# EAGLE schematic mippe_mobo (EAGLE 9.5.2)

## Sheet 1 of 2
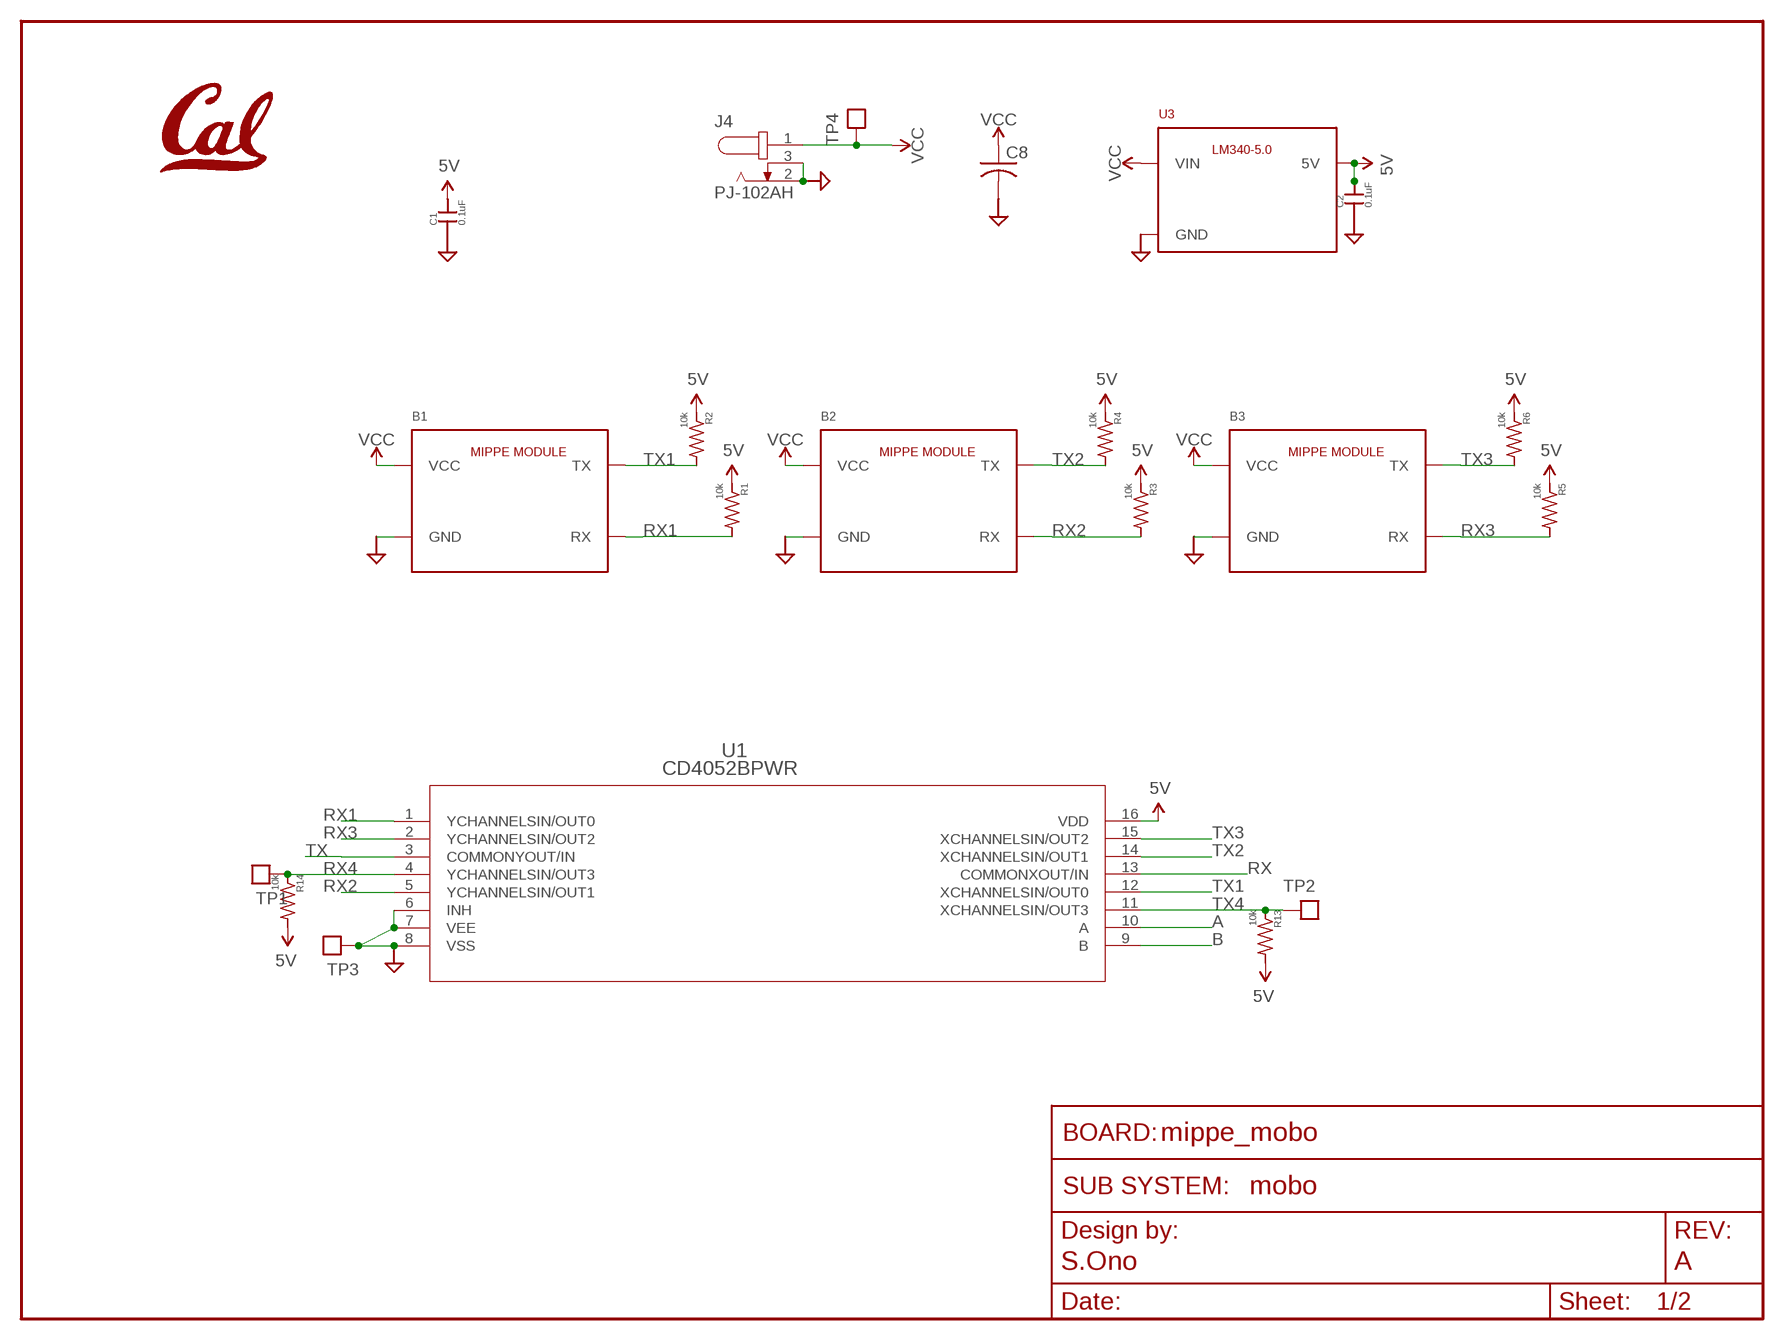
[diagram p0: schematic, sheet 1]
FRAME1 (FRAME_SCHEMATIC): AUTHOR: S.Ono; REV: A; SUBSYSTEM_NAME: mobo

### Parts
B1  MIPPE_MOD  [MIPPE_MOD]
B2  MIPPE_MOD  [MIPPE_MOD]
B3  MIPPE_MOD  [MIPPE_MOD]
C1  0.1uF  CAP0402-CAP  [0402-CAP]
C2  0.1uF  CAP0603-CAP  [0603-CAP]
C8  CAP_ELEC_3MM_SMD  [CAP_3MM]
J4  PJ-102AH  [CUI_PJ-102AH]
L1  UCB_CAL500MIL  [UCB_CAL_500MIL]
R1  10k  R-US_R0402  [R0402]
R2  10k  R-US_R0402  [R0402]
R3  10k  R-US_R0402  [R0402]
R4  10k  R-US_R0402  [R0402]
R5  10k  R-US_R0402  [R0402]
R6  10k  R-US_R0402  [R0402]
R13  10k  R-US_R0402  [R0402]
R14  10k  R-US_R0402  [R0402]
TP1  TEST_POINTTHRU  [TEST_POINT]
TP2  TEST_POINTTHRU  [TEST_POINT]
TP3  TEST_POINTTHRU  [TEST_POINT]
TP4  TEST_POINTTHRU  [TEST_POINT]
U1  CD4052BPWR  [PW16]
U3  LM340MPX-5.0230  [SOT230P700X180-4N]

### Nets
5V: C1.2 C2.2 R1.1 R2.1 R3.1 R4.1 R5.1 R6.1 R13.2 R14.2 U1.16(VDD) U3.3(5V)
A: U1.10(A) ; also sheet 2
B: U1.9(B) ; also sheet 2
GND: B1.GND@0(GND) B1.GND@1(GND) B1.GND@2(GND) B1.GND@3(GND) B2.GND@0(GND) B2.GND@1(GND) B2.GND@2(GND) B2.GND@3(GND) B3.GND@0(GND) B3.GND@1(GND) B3.GND@2(GND) B3.GND@3(GND) C1.1 C2.1 C8.NEG J4.2 J4.3 TP3.1 U1.6(INH) U1.7(VEE) U1.8(VSS) U3.2(GND) U3.4(GND) ; also sheet 2
RX: U1.13(COMMONXOUT/IN) ; also sheet 2
RX1: B1.RX R1.2 U1.1(YCHANNELSIN/OUT0)
RX2: B2.RX R3.2 U1.5(YCHANNELSIN/OUT1)
RX3: B3.RX R5.2 U1.2(YCHANNELSIN/OUT2)
RX4: R14.1 TP1.1 U1.4(YCHANNELSIN/OUT3)
TX: U1.3(COMMONYOUT/IN) ; also sheet 2
TX1: B1.TX R2.2 U1.12(XCHANNELSIN/OUT0)
TX2: B2.TX R4.2 U1.14(XCHANNELSIN/OUT1)
TX3: B3.TX R6.2 U1.15(XCHANNELSIN/OUT2)
TX4: R13.1 TP2.1 U1.11(XCHANNELSIN/OUT3)
VCC: B1.VCC@0(VCC) B1.VCC@1(VCC) B1.VCC@2(VCC) B1.VCC@3(VCC) B2.VCC@0(VCC) B2.VCC@1(VCC) B2.VCC@2(VCC) B2.VCC@3(VCC) B3.VCC@0(VCC) B3.VCC@1(VCC) B3.VCC@2(VCC) B3.VCC@3(VCC) C8.POS J4.1 TP4.1 U3.1(VIN)

## Sheet 2 of 2
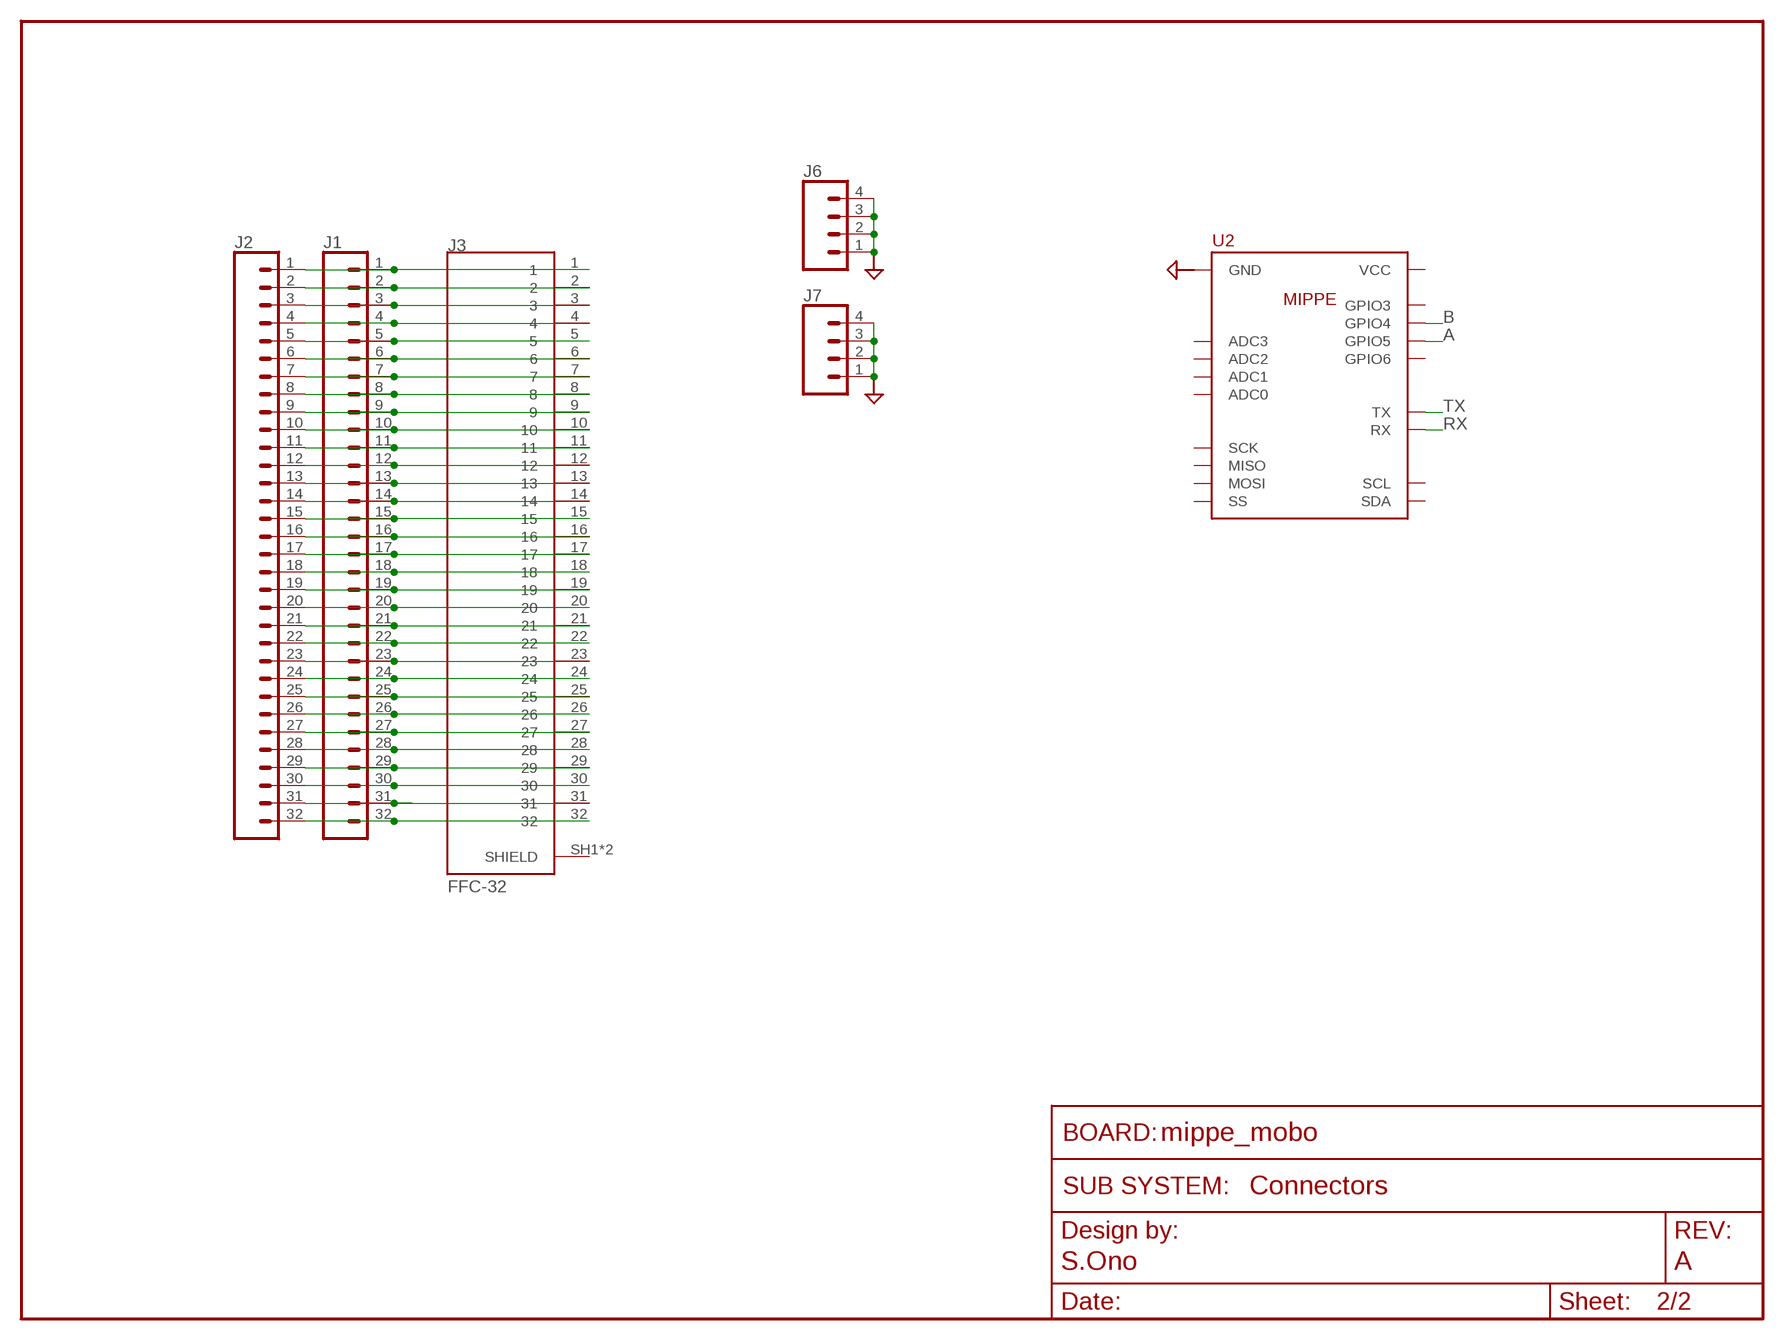
[diagram p1: schematic, sheet 2]
FRAME2 (FRAME_SCHEMATIC): AUTHOR: S.Ono; REV: A; SUBSYSTEM_NAME: Connectors

### Parts
J1  CONN_32  [1X32]
J2  CONN_32  [1X32]
J3  FFC-32  [MOLEX_503480-3200]
J6  CONN_04  [1X04]
J7  CONN_04  [1X04]
U2  MIPPE  [MIPPE]

### Nets
A: U2.GPIO5 ; also sheet 1
B: U2.GPIO4 ; also sheet 1
GND: J6.1 J6.2 J6.3 J6.4 J7.1 J7.2 J7.3 J7.4 U2.GND@0(GND) U2.GND@1(GND) ; also sheet 1
N$1: J1.1 J2.1 J3.1
N$2: J1.2 J2.2 J3.2
N$3: J1.3 J2.3 J3.3
N$4: J1.4 J2.4 J3.4
N$5: J1.5 J2.5 J3.5
N$6: J1.6 J2.6 J3.6
N$7: J1.7 J2.7 J3.7
N$8: J1.8 J2.8 J3.8
N$9: J1.9 J2.9 J3.9
N$10: J1.10 J2.10 J3.10
N$11: J1.11 J2.11 J3.11
N$12: J1.12 J2.12 J3.12
N$13: J1.13 J2.13 J3.13
N$14: J1.14 J2.14 J3.14
N$15: J1.15 J2.15 J3.15
N$16: J1.16 J2.16 J3.16
N$17: J1.17 J2.17 J3.17
N$18: J1.18 J2.18 J3.18
N$19: J1.19 J2.19 J3.19
N$20: J1.20 J2.20 J3.20
N$21: J1.21 J2.21 J3.21
N$22: J1.22 J2.22 J3.22
N$23: J1.23 J2.23 J3.23
N$24: J1.24 J2.24 J3.24
N$25: J1.25 J2.25 J3.25
N$26: J1.26 J2.26 J3.26
N$27: J1.27 J2.27 J3.27
N$28: J1.28 J2.28 J3.28
N$29: J1.29 J2.29 J3.29
N$30: J1.30 J2.30 J3.30
N$31: J1.31 J2.31 J3.31
N$32: J1.32 J2.32 J3.32
RX: U2.RX ; also sheet 1
TX: U2.TX ; also sheet 1
Unconnected: J3.SH1(SHIELD) J3.SH2(SHIELD) U2.ADC0 U2.ADC1 U2.ADC2 U2.ADC3 U2.GPIO3 U2.GPIO6 U2.MISO U2.MOSI U2.SCK U2.SCL U2.SDA U2.SS U2.VCC U2.VCC@1(VCC)

## Library data of the parts
B1-B3 = scono:MIPPE_MOD
C1 C2 = scono:CAP: Capacitor Standard 0603 ceramic capacitor, and 0.1" leaded capacitor.; PIE-INT-REF-NUM: CAPACITOR-GENERIC
C8 = scono:CAP_ELEC: https://www.digikey.com/product-detail/en/nichicon/UWX1C100MCL2GB/493-2099-1-ND/590074
J1 J2 = scono:CONN_32: Multi connection point. Often used as Generic Header-pin footprint for 0.1 inch spaced/style header connections On any of the 0.1 inch spaced packages, you can populate with these: Break Away Headers - Straight <https://www.sparkfun.com/products/116> (PRT-00116) Break Away Male Headers - Right Angle <https://www.sparkfun.com/products/553> (PRT-00553) Female Headers <https://www.sparkfun.com/products/115> (PRT-00115) Break Away Headers - Machine Pin <https://www.sparkfun.com/products/117> (PRT-00117) Break Away Female Headers - Swiss Machine Pin <https://www.sparkfun.com/products/743> (PRT-00743) Arduino Stackable Header - 8 Pin <https://www.sparkfun.com/products/9279> (PRT-09279) For SCREWTERMINALS and SPRING TERMINALS visit here: Screw Terimnals on SparkFun.com <https://www.sparkfun.com/search/results?term=Screw+Terminals> (5mm/3.5mm/2.54mm spacing) This device is also useful as a general connection point to wire up your design to another part of your project. Our various solder wires solder well into these plated through hole pads. Hook-Up Wire - Assortment (Stranded, 22 AWG) <https://www.sparkfun.com/products/11375> (PRT-11375) Hook-Up Wire - Assortment (Solid Core, 22 AWG) <https://www.sparkfun.com/products/11367> (PRT-11367) View the entire wire category on our website here <https://www.sparkfun.com/categories/141> Special notes: Molex polarized connector foot print use with SKU : PRT-08231 with associated crimp pins and housings. 1MM SMD Version SKU: PRT-10208 NOTES ON THE VARIANTS LOCK and LOCK_LONGPADS... This footprint was designed to help hold the alignment of a through-hole component (i.e. 6-pin header) while soldering it into place. You may notice that each hole has been shifted either up or down by 0.005 of an inch from it's more standard position (which is a perfectly straight line). This slight alteration caused the pins (the squares in the middle) to touch the edges of the holes. Because they are alternating, it causes a "brace" to hold the component in place. 0.005 has proven to be the perfect amount of "off-center" position when using our standard breakaway headers. Although looks a little odd when you look at the bare footprint, once you have a header in there, the alteration is very hard to notice. Also,if you push a header all the way into place, it is covered up entirely on the bottom side.
J3 = scono:FFC-32: 0.50mm Pitch Easy-On™ BackFlip™ Type FPC Connector, 1.00mm Height, Right Angle, SMT, Dual Contact Style, 32 Circuits; DESCRIPTION: 0.50mm Pitch Easy-On™ BackFlip™ Type FPC Connector, 1.00mm Height, Right Angle, Surface Mount, Dual Contact Style, 32...; DIGI-KEY_PART_NUMBER: WM11115CT-ND; DIGI-KEY_PURCHASE_URL: https://www.digikey.com/product-detail/en/molex/5034803200/WM11115CT-ND/5171273?utm_source=snapeda&utm_medium=aggregator&utm_campaign=symbol; MF: Molex; MP: 5034803200; PACKAGE: None
J4 = scono:PJ-102AH: 2.0 mm Center Pin, 5.0 A, Right Angle, Through Hole, Tapered Pins, Dc Power Jack Connector; AVAILABILITY: Unavailable; CUI_PURCHASE_URL: https://www.cuidevices.com/product/interconnect/connectors/dc-power-connectors/jacks/pj-102ah?utm_source=snapeda.com&utm_medium=referral&utm_campaign=snapedaBOM; DESCRIPTION: 2.0 x 6.5 mm, 5.0 A, Horizontal, Through Hole, Tapered Pins, Dc Power Jack Connector; MF: CUI Devices; MP: PJ-102AH; PACKAGE: None; PRICE: None
J6 J7 = scono:CONN_04: Multi connection point. Often used as Generic Header-pin footprint for 0.1 inch spaced/style header connections On any of the 0.1 inch spaced packages, you can populate with these: Break Away Headers - Straight <https://www.sparkfun.com/products/116> (PRT-00116) Break Away Male Headers - Right Angle <https://www.sparkfun.com/products/553> (PRT-00553) Female Headers <https://www.sparkfun.com/products/115> (PRT-00115) Break Away Headers - Machine Pin <https://www.sparkfun.com/products/117> (PRT-00117) Break Away Female Headers - Swiss Machine Pin <https://www.sparkfun.com/products/743> (PRT-00743) For SCREWTERMINALS and SPRING TERMINALS visit here: Screw Terimnals on SparkFun.com <https://www.sparkfun.com/search/results?term=Screw+Terminals> (5mm/3.5mm/2.54mm spacing) This device is also useful as a general connection point to wire up your design to another part of your project. Our various solder wires solder well into these plated through hole pads. Hook-Up Wire - Assortment (Stranded, 22 AWG) <https://www.sparkfun.com/products/11375> (PRT-11375) Hook-Up Wire - Assortment (Solid Core, 22 AWG) <https://www.sparkfun.com/products/11367> (PRT-11367) View the entire wire category on our website here <https://www.sparkfun.com/categories/141> Special notes: Molex polarized connector foot print use with SKU : PRT-08231 with associated crimp pins and housings. 1MM SMD Version SKU: PRT-10208; PROD_ID: CONN-09696
L1 = scono:UCB_CAL
R1-R6 R13 R14 = scono:R-US_: RESISTOR, American symbol
TP1-TP4 = scono:TEST_POINT: 1206 Test point for O-scope probes. For A106146CT-ND or similar
U1 = scono:CD4052BPWR; BUILT_BY: EMA_UL_Team; MANUFACTURER: Texas Instruments; MANUFACTURER_PART_NUMBER: CD4052BPWR; VENDOR: Vendor
U2 = scono:MIPPE
U3 = scono:LM340MPX-5.0

## Net classes
1 supply: width 0.152 mm, drill 0.152 mm, clearance 0.152 mm